# Altium schematic sheet PAGE2-POWER.SchDoc
size A3; DocumentNumber: 2; SheetNumber: 6; SheetTotal: 2
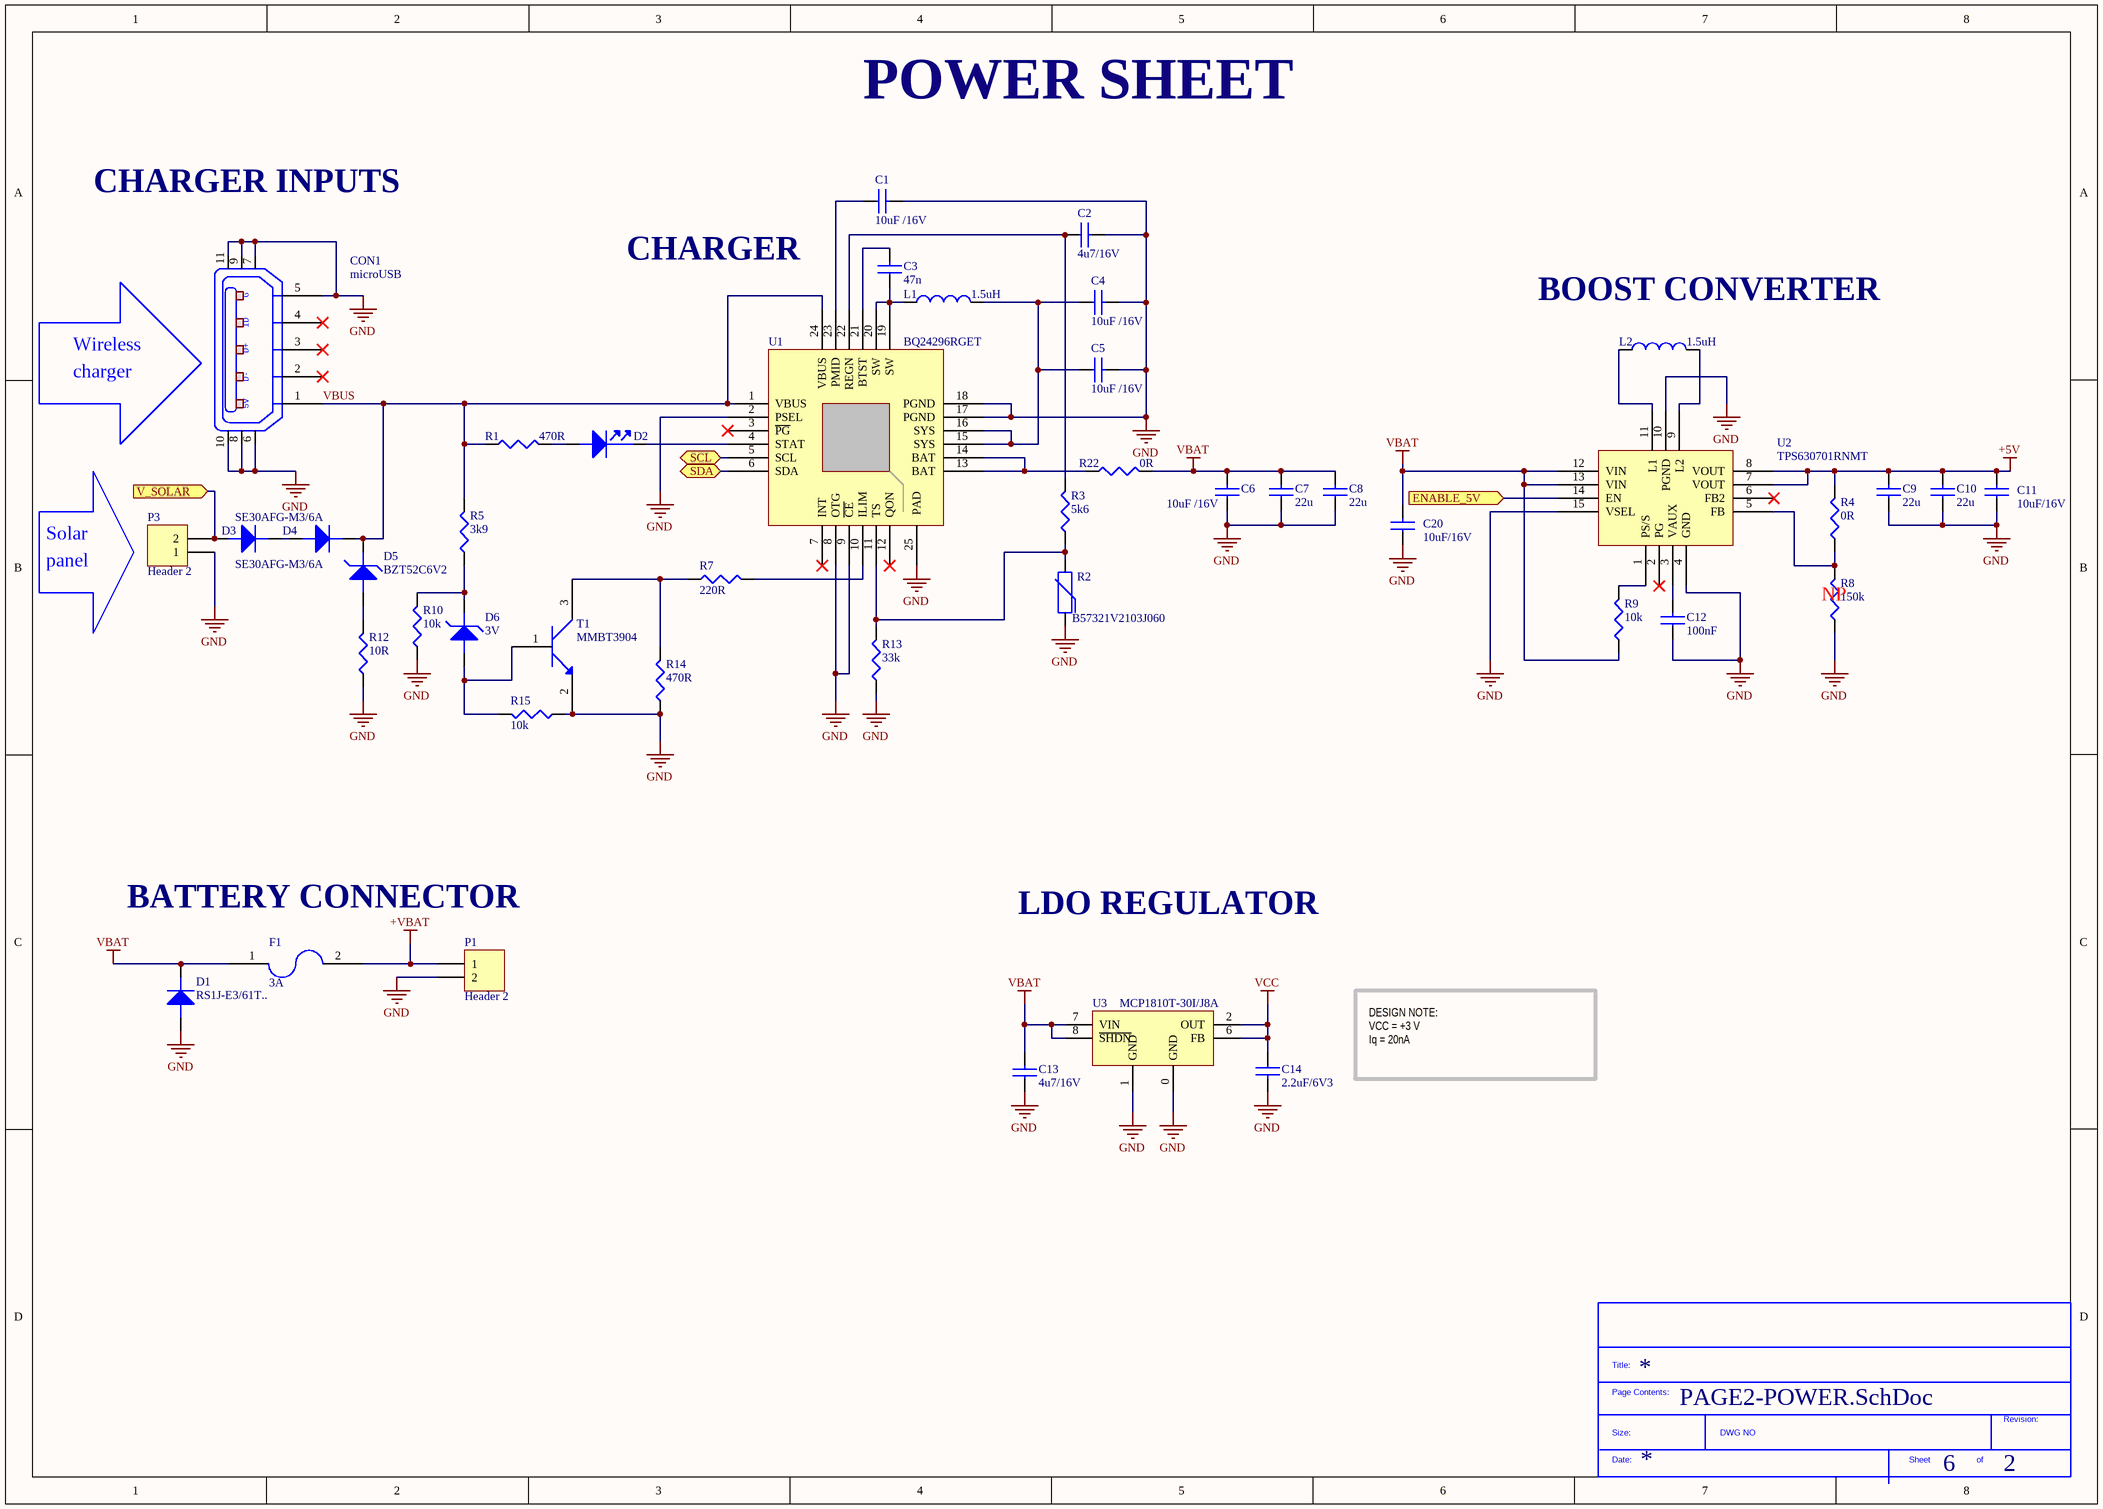
[diagram p0: PAGE2-POWER.SchDoc]

## Parts
*?  SDTitleBlock  (value not drawn)  (graphical)
C1  10uF /16V  [CAP0805]
C2  4u7/16V  [CAP0603]
C3  47n  [CAP0603]
C4  10uF /16V  [CAP0805]
C5  10uF /16V  [CAP0805]
C6  10uF /16V  [CAP0805]
C7  22u  [CAP0805]
C8  22u  [CAP0805]
C9  22u  [CAP0805]
C10  22u  [CAP0805]
C11  10uF/16V  [CAP0603]
C12  100nF  [CAP0603]
C13  4u7/16V  [CAP0603]
C14  2.2uF/6V3  [CAP0603]
C20  10uF/16V  [CAP0603]
CON1  microUSB  [microUSB-CHINA]  (no BOM)
D1  RS1J-E3/61T..  [SMC/DO-214AC]
D2  LED RED  [LED0603]  (value not drawn)
D3  SE30AFG-M3/6A  [SODFL127P600-8N]
D4  SE30AFG-M3/6A  [SODFL127P600-8N]
D5  BZT52C6V2  [SOD123]
D6  3V  [SOD-323 2L]
F1  3A  [Chip2PinSM127P600-8N]
L1  1.5uH  [FDSD0402]
L2  1.5uH  [FDSD0402]
P1  Header 2  [HDR1X2]  (no BOM)
P3  Header 2  [HDR1X2]  (no BOM)
R1  470R  [RES0603]
R2  B57321V2103J060  [RES0603]
R3  5k6  [RES0603]
R4  0R  [RES0603]
R5  3k9  [RES0603]
R7  220R  [RES0603]
R8  150k  [RES0603]
R9  10k  [RES0603]
R10  10k  [RES0603]
R12  10R  [RES0603]
R13  33k  [RES0603]
R14  470R  [RES0603]
R15  10k  [RES0603]
R22  0R  [RES0603]
T1  MMBT3904  [SOT23127P600-8N]
U1  BQ24296RGET  [QFN4x4]
U2  TPS630701RNMT  [VQFN TPS]
U3  MCP1810T-30I/J8A  [VDFN_2x2]

## Ports
ENABLE_5V (in), SCL (bidir), SDA (bidir), V_SOLAR (in)

## Nets
+5V: C9.2 C10.2 C11.2 R4.2 U2.7(VOUT) U2.8(VOUT)
+VBAT: F1.2 P1.1
GND: C1.2 C2.2 C4.2 C5.2 C6.1 C7.1 C8.1 C9.1 C10.1 C11.1 C12.1 C13.1 C14.2 C20.1 CON1.5(P5) CON1.6 CON1.7 CON1.8 CON1.9 CON1.10 CON1.11 D1.2(ANODE) P1.2 P3.1 R2.1 R8.1 R10.1 R12.1 R13.1 R14.1 R15.1 T1.2 U1.2(PSEL) U1.8(OTG) U1.9(~{CE}) U1.17(PGND) U1.18(PGND) U1.25(PAD) U2.4(GND) U2.10(PGND) U2.15(VSEL) U3.0(GND) U3.1(GND)
VBAT: C6.2 C7.2 C8.2 C13.2 C20.2 D1.1(cathode) F1.1 R9.1 R22.2 U2.12(VIN) U2.13(VIN) U3.7(VIN) U3.8(~{SHDN})
VCC: C14.1 U3.2(OUT) U3.6(FB)
ENABLE_5V: U2.14(EN) ; port ENABLE_5V
SCL: U1.5(SCL) ; port SCL
SDA: U1.6(SDA) ; port SDA
V_SOLAR: D3.2(ANODE) P3.2 ; port V_SOLAR
VBUS: CON1.1(P1) D4.1(cathode) D5.1(cathode) R1.1 R5.2 U1.1(VBUS) U1.24(VBUS)
NetC1_1: C1.1 U1.23(PMID)
NetC2_1: C2.1 R3.2 U1.22(REGN)
NetC3_1: C3.1 L1.1 U1.19(SW) U1.20(SW)
NetC3_2: C3.2 U1.21(BTST)
NetC4_1: C4.1 C5.1 L1.2 U1.15(SYS) U1.16(SYS)
NetC12_2: C12.2 U2.3(VAUX)
NetD2_1: D2.1(cathode) U1.4(STAT)
NetD2_2: D2.2(ANODE) R1.2
NetD3_1: D3.1(cathode) D4.2(ANODE)
NetD5_2: D5.2(ANODE) R12.2
NetD6_1: D6.1(cathode) R5.1 R10.2
NetD6_2: D6.2(ANODE) R15.2 T1.1
NetL2_1: L2.1 U2.11(L1)
NetL2_2: L2.2 U2.9(L2)
NetR2_2: R2.2 R3.1 R13.2 U1.11(TS)
NetR4_1: R4.1 R8.2 U2.5(FB)
NetR7_1: R7.1 R14.2 T1.3
NetR7_2: R7.2 U1.10(ILIM)
NetR9_2: R9.2 U2.1(PS/S)
NetR22_1: R22.1 U1.13(BAT) U1.14(BAT)

Not connected (* = marked no-connect by the designer): CON1 2(P2)* 3(P3)* 4(P4)*; U1 3(~{PG})* 7(INT)* 12(QON)*; U2 2(PG)* 6(FB2)*

## Notes on the sheet
- POWER SHEET
- CHARGER INPUTS
- CHARGER
- (near L2) BOOST CONVERTER
- Wireless
- charger
- Solar
- panel
- (near R8) NP
- BATTERY CONNECTOR
- LDO REGULATOR
- DESIGN NOTE:
  VCC = +3 V
  Iq = 20nA
- (in symbol Micro USB CHINA 1) G; ID; D+; D-; 5V
- (in symbol SDTitleBlock) Title:; Page Contents:; Revision:; Size:; DWG NO; Date:; Sheet; of

## Library data of the parts
C1 C4-C6 = 10uF /16V: TDK - CGA4J1X5R1C106K125AC - CAP, MLCC, X5R, 10UF, 16V, 0805; Manufacturer: TDK; Manufacturer Part Number: CGA4J1X5R1C106K125AC; RoHS: YES; ComponentLink1URL: http://bcove.me/e1v54mtm; ComponentLink1Description: http://bcove.me/e1v54mtm; ComponentLink2URL: http://www.farnell.com/datasheets/1936565.pdf; ComponentLink2Description: http://www.farnell.com/datasheets/1936565.pdf; ComponentLink3URL: http://www.farnell.com/datasheets/1683658.pdf; ComponentLink3Description: http://www.farnell.com/datasheets/1683658.pdf; Supplier 1: Farnell; Supplier Part Number 1: 2320856
C2 = 4u7  16V 0603: MURATA - GRM188R61C475KAAJD - CAP, MLCC, X5R, 4.7UF, 16V, 0603; Ceramic Capacitor Case: 0603 [1608 Metric]; Capacitance: 4.7; Voltage Rating: 16; Capacitance Tolerance: ± 10%; Dielectric Characteristic: X5; Product Range: GRM Series; SVHC: No SVHC (17-Dec-2015)<!--FANDB--><div class="features-and-benefits-container"><div class="features-and-benefits-desc-container"><span class="features-and-benefits-container-desc">SMD Multilayer Ceramic Capacitor, 0603 [1608 Metric], 4.7 µF, 16 V, ± 10%, X5; Supplier 1: Farnell; Manufacturer: MURATA; Manufacturer Part Number: GRM188R61C475KAAJD; RoHS: YES; Stock 1: 5038; Pricing 1: 10=0.16, 100=0.0929, 500=0.076, 1000=0.0618, 2000=0.0605, 4000=0.0425, 20000=0.0409, 40000=0.0355 (GBP); Packaging: Cut Tape; Operating Temperature Min: -55; Operating Temperature Max: 85; Automotive Qualification Standard: -; MSL: MSL 1 - Unlimited; ComponentLink1URL: http://www.farnell.com/datasheets/2079168.pdf; ComponentLink1Description: http://www.farnell.com/datasheets/2079168.pdf; Supplier Part Number 1: 2611924
C3 = 47nF / 50V: MULTICOMP - MC0603B473K500CT - CAP, MLCC, X7R, 47NF, 50V, 0603; Supplier 1: Farnell; Manufacturer: MULTICOMP; Manufacturer Part Number: MC0603B473K500CT; RoHS: YES; Stock 1: 34893; Pricing 1: 10=0.0102, 100=0.0086, 500=0.0069, 1000=0.0059, 2000=0.0051 (GBP); ComponentLink1URL: http://www.farnell.com/datasheets/1901289.pdf; ComponentLink1Description: http://www.farnell.com/datasheets/1901289.pdf; Supplier Part Number 1: 1759116
C7-C10 = 22u 6.3V 0805: MULTICOMP - MC0805X226M6R3CT - CAP, MLCC, X5R, 22UF, 0805; Ceramic Capacitor Case: 0805 [2012 Metric]; Capacitance: 22; Voltage Rating: 6.3; Capacitance Tolerance: ± 20%; Dielectric Characteristic: X5; Product Range: MC Series; SVHC: No SVHC (07-Jul-2017); Capacitor Terminals: SMD; Supplier 1: Farnell; Manufacturer: MULTICOMP; Manufacturer Part Number: MC0805X226M6R3CT; RoHS: YES; Stock 1: 74736; Pricing 1: 5=0.128, 50=0.0738, 250=0.0507, 500=0.042, 1500=0.0358 (GBP); Packaging: Cut Tape; Operating Temperature Min: -55; Operating Temperature Max: 85; Automotive Qualification Standard: -; MSL: -; Capacitance Tolerance ±: ± 20%; Operating Temperature Range: -55°C to +85°C<!--FANDB--><div class="features-and-benefits-container"><div class="features-and-benefits-desc-container"><span class="features-and-benefits-container-desc">SMD Multilayer Ceramic Capacitor, 0805 [2012 Metric], 22 µF, 6.3 V, ± 20%, X5R, MC Series</span></div><div class="features-and-benefits-description"><span class="features-benefits-value">The Multicomp MC series is general purpose MLCC capacitors with X5R dielectric material which provides high electrical precision, stability and reliability. This MLCC capacitor consists of a conducting material and electrodes with high density and high efficiency ceramic condensers.</span></div><div class="features-and-benefits-list"><ul class="features-and-benefits-list-list"><li class="features-and-benefits-list-item">Small size with higher capacitance values</li><li class="features-and-benefits-list-item">0201, 0402, 0603, 0805, 1206, 1210, 1812 case sizes available</li><li class="features-and-benefits-list-item">Capacitance value ranging from 100pF to 220?F</li><li class="features-and-benefits-list-item">Capacitor with lead free termination (pure Tin)</li><li class="features-and-benefits-list-item">High electrical precision, stability and reliability</li><li class="features-and-benefits-list-item">Rated voltage of 4V, 6.3V, 10V, 16V, 25V, 50V</li><li class="features-and-benefits-list-item">Operating temperature of -55°C to +85°C</li><li class="features-and-benefits-list-item">Available in ±10% and ±20; ComponentLink1URL: http://www.farnell.com/datasheets/1901289.pdf; ComponentLink1Description: http://www.farnell.com/datasheets/1901289.pdf; ComponentLink2URL: http://www.farnell.com/datasheets/1932399.pdf; ComponentLink2Description: http://www.farnell.com/datasheets/1932399.pdf; Supplier Part Number 1: 1759415
C11 C20 = 10uF/16V/0603: Multilayer Ceramic Capacitors MLCC - SMD/SMT 0603 10uF 16volts X5R 10%; Manufacturer: Murata; Manufacturer Part Number: GRM188R61C106KAALD; Voltage Rating DC: 16 VDC; Brand: Murata Electronics; Class: Class 2; Type: General Purpose Ceramic Capacitors; Unit Weight: 0.000222 oz; Supplier 1: Farnell; Stock 1: 13160; Pricing 1: 10=0.442, 100=0.241, 500=0.166, 1000=0.129 (GBP); Product Category: Multilayer Ceramic Capacitors MLCC - SMD/SMT; RoHS: True; Capacitance: 10 uF; Dielectric: X5R; Tolerance: 10 %; Case Code - in: 0603; Case Code - mm: 1608; Height: 0.8 mm; Maximum Operating Temperature: + 85 C; Minimum Operating Temperature: - 55 C; Product: General Type MLCCs; Series: GRM; Packaging: Reel; Length: 1.6 mm; Package / Case: 0603 (1608 metric); Factory Pack Quantity: 4000; Termination Style: SMD/SMT; Width: 0.8 mm; Supplier Part Number 1: 2611923
C12 = 100nF: MURATA - GRM188R71C104KA01J - CAP, MLCC, X7R, 0.1UF, 16V, 0603; Ceramic Capacitor Case: 0603 [1608 Metric]; Capacitance: 0.1; Voltage Rating: 16; Capacitance Tolerance: ± 10%; Dielectric Characteristic: X7; Product Range: GRM Series; SVHC: No SVHC (20-Jun-2016; Supplier 1: Farnell; Manufacturer: MURATA; Manufacturer Part Number: GRM188R71C104KA01J; RoHS: YES; Stock 1: 18297; Pricing 1: 10=0.0145, 100=0.0126, 500=0.0081, 2500=0.0059, 5000=0.0052, 10000=0.0046, 50000=0.0036, 100000=0.0035 (GBP); Packaging: Cut Tape; Operating Temperature Min: -55; Operating Temperature Max: 125; Automotive Qualification Standard: -; MSL: MSL 1 - Unlimited; ComponentLink1URL: http://www.farnell.com/datasheets/2189124.pdf; ComponentLink1Description: http://www.farnell.com/datasheets/2189124.pdf; Supplier Part Number 1: 2688519
C13 = C - 4u7  16V 0603: MURATA - GRM188R61C475KAAJD - CAP, MLCC, X5R, 4.7UF, 16V, 0603; IRNAS Part No.: I-200001; Ceramic Capacitor Case: 0603 [1608 Metric]; Capacitance: 4.7; Voltage Rating: 16; Capacitance Tolerance: ± 10%; Dielectric Characteristic: X5; Product Range: GRM Series; SVHC: No SVHC (17-Dec-2015)<!--FANDB--><div class="features-and-benefits-container"><div class="features-and-benefits-desc-container"><span class="features-and-benefits-container-desc">SMD Multilayer Ceramic Capacitor, 0603 [1608 Metric], 4.7 µF, 16 V, ± 10%, X5; Supplier 1: Farnell; Manufacturer: MURATA; Manufacturer Part Number: GRM188R61C475KAAJD; RoHS: YES; Stock 1: 5038; Pricing 1: 10=0.16, 100=0.0929, 500=0.076, 1000=0.0618, 2000=0.0605, 4000=0.0425, 20000=0.0409, 40000=0.0355 (GBP); Packaging: Cut Tape; Operating Temperature Min: -55; Operating Temperature Max: 85; Automotive Qualification Standard: -; MSL: MSL 1 - Unlimited; ComponentLink1URL: http://www.farnell.com/datasheets/2079168.pdf; ComponentLink1Description: http://www.farnell.com/datasheets/2079168.pdf; Supplier Part Number 1: 2611924
C14 = C - 2.2uF/6V3/0603: SMD Multilayer Ceramic Capacitor, 2.2 µF, 6.3 V, 0603 [1608 Metric], ± 10%, X5R, MC Series; ComponentLink1Description: Datashet; ComponentLink1URL: http://www.farnell.com/datasheets/1901289.pdf?_ga=2.188069613.43509124.1568358807-1741076818.1563951383; Supplier 1: Farnell; Supplier Part Number 1: 1759392
CON1 = Micro USB CHINA 1
D1 = RS1J-E3/61T..: VISHAY - RS1J-E3/61T.. - DIODE, FAST, 1A, 600V, SMD; Repetitive Reverse Voltage Vrrm Max: 600; Forward Current If(AV): 1; Diode Configuration: Single; Forward Voltage VF Max: 1.3; Reverse Recovery Time trr Max: 250; Forward Surge Current Ifsm Max: 30; Diode Case Style: DO-214; No. of Pins: 2 Pin; Product Range: RS1; SVHC: No SVHC (15-Jun-2015); Diode Type: Fast Recovery; External Depth: 2.79; External Length / Height: 2.29; External Width: 5.28; Junction Temperature Tj Max: 150; Supplier 1: Farnell; Manufacturer: VISHAY; Manufacturer Part Number: RS1J-E3/61T..; RoHS: YES; Stock 1: 4705; Pricing 1: 10=0.164, 100=0.111, 200=0.093, 500=0.0847, 1000=0.083, 3000=0.0813, 9000=0.0796, 30000=0.0779 (GBP); Operating Temperature Max: 150; Packaging: Cut Tape; Automotive Qualification Standard: -; Alternate Case Style: DO-214; Current Ifsm: 30; Forward Current If Max: 1; Forward Voltage: 1.3; Operating Temperature Min: -55; Operating Temperature Range: -55°C to +150; Tape Width: 12mm<!--FANDB--><div class="features-and-benefits-container"><div class="features-and-benefits-desc-container"><span class="features-and-benefits-container-desc">Fast / Ultrafast Diode, 600 V, 1 A, Single, 1.3 V, 250 ns, 30 A</span></div><div class="features-and-benefits-description"><span class="features-benefits-value">The RS1J-E3/5AT is a surface-mount Fast Switching Rectifier with solderable matte tin-plated terminals. It is suitable for use in fast switching rectification of power supply, inverters, converters and freewheeling diodes.</span></div><div class="features-and-benefits-list"><ul class="features-and-benefits-list-list"><li class="features-and-benefits-list-item">Colour band denotes cathode end</li><li class="features-and-benefits-list-item">Low-profile package</li><li class="features-and-benefits-list-item">Ideal for automated placement</li><li class="features-and-benefits-list-item">Glass-passivated pallet chip junction</li><li class="features-and-benefits-list-item">Fast switching for high efficiency</li><li class="features-and-benefits-list-item">High forward surge capability</li><li class="features-and-benefits-list-item">Meets MSL level 1 as per J-STD-020, LF maximum peak of 260°C</li><li class="features-and-benefits-list-item">AEC-Q101 qualified</li><li class="features-and-benefits-list-item">UL94V-0 Flammability rating</li></ul></div><div class="features-and-benefits-applications"><ul class="features-and-benefits-value"><li class="features-and-benefits-list-item">Power Management</li><li class="features-and-benefits-list-item">Consumer Electronics</li><li class="features-and-benefits-list-item">Commercial</li><li class="features-and-benefits-list-item">Communications & Networking</li><li class="features-and-benefits-list-item">Automotive</li></ul></div></div>; ComponentLink1URL: http://www.vishay.com/docs/88869/packagin.pdf; ComponentLink1Description: http://www.vishay.com/docs/88869/packagin.pdf; ComponentLink2URL: http://www.vishay.com/doc?88707; ComponentLink2Description: http://www.vishay.com/doc?88707; ComponentLink3URL: http://www.farnell.com/datasheets/2244878.pdf; ComponentLink3Description: http://www.farnell.com/datasheets/2244878.pdf; Supplier Part Number 1: 9550143
D2 = LED RED: BROADCOM LIMITED - HSMS-C190 - LED, RED, 10MCD, 626NM; LED Mounting: SMD; Forward Current If: 20; Forward Voltage: 2.1; Wavelength Typ: 626; Luminous Intensity: 10; Viewing Angle: 170°; Lens Shape: Rectangular; SVHC: No SVHC (17-Dec-2015)<!--FANDB--><div class="features-and-benefits-container"><div class="features-and-benefits-description"><span class="features-benefits-value">The HSMS-C190 is a HER SMD Chip LED with untinted/diffused lens, made of GaP. It is designed in an industry standard package 1.6 x 0.8mm footprint with 0.8mm profile. It is compatible with IR reflow solder processes. The small size and wide viewing angle make this LED prime choices for backlighting applications and front panel illumination especially where space is a premium.</span></div><div class="features-and-benefits-list"><ul class="features-and-benefits-list-list"><li class="features-and-benefits-list-item">Small size</li><li class="features-and-benefits-list-item">Industry standard footprint</li><li class="features-and-benefits-list-item">Compatible with IR solder</li><li class="features-and-benefits-list-item">Diffused optics</li><li class="features-and-benefits-list-item">-40 to 85; Supplier 1: Farnell; Manufacturer: BROADCOM LIMITED; Manufacturer Part Number: HSMS-C190; RoHS: YES; Stock 1: 7534; Pricing 1: 1=0.361, 10=0.256, 50=0.235, 100=0.106, 200=0.101 (GBP); LED Colour: Red; Bulb Size: -; Packaging: Cut Tape; Product Range: -; Automotive Qualification Standard: -; MSL: -; ComponentLink1URL: http://www.farnell.com/datasheets/313031.pdf; ComponentLink1Description: http://www.farnell.com/datasheets/313031.pdf; ComponentLink2URL: http://www.farnell.com/datasheets/1681524.pdf; ComponentLink2Description: http://www.farnell.com/datasheets/1681524.pdf; ComponentLink3URL: http://www.farnell.com/datasheets/2165483.pdf; ComponentLink3Description: http://www.farnell.com/datasheets/2165483.pdf; Supplier Part Number 1: 2497356
D3 D4 = SE30AFG-M3/6A: VISHAY - SE30AFG-M3/6A - RECTIFIER, ESD, 400V, 3A, DO-221AC; Repetitive Reverse Voltage Vrrm Max: 400; Forward Current If(AV): 3; Diode Configuration: Single; Forward Voltage VF Max: 1.1; Reverse Recovery Time trr Max: 1.5; Forward Surge Current Ifsm Max: 40; Diode Case Style: DO-221; No. of Pins: 2; Product Range: SE30; Diode Type: Standard Recovery; Supplier 1: Farnell; Manufacturer: VISHAY; Manufacturer Part Number: SE30AFG-M3/6A; RoHS: YES; Stock 1: 13984; Pricing 1: 1=0.306, 25=0.0765, 100=0.0753, 250=0.0729, 500=0.072, 1000=0.0654 (GBP); Operating Temperature Max: 175; Packaging: Each; Automotive Qualification Standard: -; MSL: MSL 1 - Unlimited; Operating Temperature Min: -55°C<!--FANDB--><div class="features-and-benefits-container"><div class="features-and-benefits-desc-container"><span class="features-and-benefits-container-desc">Standard Recovery Diode, 400 V, 3 A, Single, 1.1 V, 1.5 µs, 40 A</span></div><div class="features-and-benefits-description"><span class="features-benefits-value">The SE30AFG-M3/6A is a surface-mount ESD Capability Rectifier with matte tin-plated solderable leads. It is suitable for use in general-purpose, polarity protection and rail-to-rail protection.</span></div><div class="features-and-benefits-list"><ul class="features-and-benefits-list-list"><li class="features-and-benefits-list-item">Oxide planar chip junction</li><li class="features-and-benefits-list-item">Low forward voltage drop, low leakage current</li><li class="features-and-benefits-list-item">Very low profile - Typical height of 0.95; ComponentLink1URL: http://www.farnell.com/datasheets/2049981.pdf; ComponentLink1Description: http://www.farnell.com/datasheets/2049981.pdf; Supplier Part Number 1: 2313878
D5 = BZT52C6V2: DIODES INC. - BZT52C6V2 - DIODE, ZENER, 6.2V, 0.5W, SOD-123; Zener Voltage Vz Typ: 6.2; Power Dissipation Pd: 500; Zener Tolerance ±: 6%; No. of Pins: 2; Product Range: BZT52 Series; SVHC: No SVHC (12-Jan-2017); Supplier 1: Farnell; Manufacturer: DIODES INC.; Manufacturer Part Number: BZT52C6V2; RoHS: YES; Stock 1: 4408; Pricing 1: 1=0.415, 25=0.264, 100=0.0727, 250=0.0546, 500=0.047, 1000=0.0334, 3000=0.0278, 7000=0.0236 (GBP); Diode Case Style: SOD-123; Operating Temperature Max: 150; Packaging: Cut Tape; Automotive Qualification Standard: -; MSL: MSL 1 - Unlimited; Operating Temperature Min: -65; Operating Temperature Range: -65°C to +150°C<!--FANDB--><div class="features-and-benefits-container"><div class="features-and-benefits-desc-container"><span class="features-and-benefits-container-desc">Zener Single Diode, 6.2 V, 500 mW, SOD-123, 6 %, 2 Pins, 150 °C</span></div><div class="features-and-benefits-description"><span class="features-benefits-value">The BZT52C6V2 is a surface mount Zener Diode with moulded plastic case, matte tin annealed over Alloy 42 lead frame (lead-free plating) terminals and cathode band polarity. It is ideally suited for automated assembly processes.</span></div><div class="features-and-benefits-list"><ul class="features-and-benefits-list-list"><li class="features-and-benefits-list-item">Planar die construction</li><li class="features-and-benefits-list-item">500mW Power dissipation</li><li class="features-and-benefits-list-item">General purpose, medium current</li><li class="features-and-benefits-list-item">Totally lead-free</li><li class="features-and-benefits-list-item">Halogen and antimony-free - Green device</li><li class="features-and-benefits-list-item">Qualified to AEC-Q101 standards for high reliability</li></ul></div><div class="features-and-benefits-applications"><ul class="features-and-benefits-value"><li class="features-and-benefits-list-item">Automation & Process Control</li></ul></div></div>; ComponentLink1URL: http://www.farnell.com/datasheets/1670962.pdf; ComponentLink1Description: http://www.farnell.com/datasheets/1670962.pdf; Supplier Part Number 1: 1902438
D6 = MM3Z3V0T1G: ON SEMICONDUCTOR - MM3Z3V0T1G - ZENER DIODE, 200MW, 3V, SOD-323; Zener Voltage Vz Typ: 3; Power Dissipation Pd: 300; Zener Tolerance ±: 5%; No. of Pins: 2; Product Range: MM3Z3 Series; SVHC: No SVHC (07-Jul-2017); Supplier 1: Farnell; Manufacturer: ON SEMICONDUCTOR; Manufacturer Part Number: MM3Z3V0T1G; RoHS: YES; Stock 1: 6591; Pricing 1: 5=0.126, 50=0.0544, 250=0.0443, 500=0.0288, 1500=0.0274 (GBP); Diode Case Style: SOD-323; Operating Temperature Max: 150; Packaging: Cut Tape; Automotive Qualification Standard: -; MSL: MSL 1 - Unlimited<!--FANDB--><div class="features-and-benefits-container"><div class="features-and-benefits-desc-container"><span class="features-and-benefits-container-desc">Zener Single Diode, 3 V, 300 mW, SOD-323, 5 %, 2 Pins, 150 °C</span></div></div>; ComponentLink1URL: http://www.farnell.com/datasheets/1876691.pdf; ComponentLink1Description: http://www.farnell.com/datasheets/1876691.pdf; ComponentLink2URL: http://www.farnell.com/datasheets/2306645.pdf; ComponentLink2Description: http://www.farnell.com/datasheets/2306645.pdf; Supplier Part Number 1: 2463510
F1 = PTC FUSE 3A: LITTELFUSE - MINISMDC150F/24-2 - POLYSWITCH, SMD, 1812, 1.5A; Supplier 1: Farnell; Manufacturer: LITTELFUSE; Manufacturer Part Number: MINISMDC150F/24-2; RoHS: YES; Stock 1: 9256; Pricing 1: 1=0.463, 50=0.382, 100=0.327, 250=0.302, 500=0.256, 1000=0.254, 5000=0.253, 10000=0.251 (GBP); ComponentLink1URL: http://www.farnell.com/datasheets/2363925.pdf; ComponentLink1Description: http://www.farnell.com/datasheets/2363925.pdf; ComponentLink2URL: http://www.farnell.com/datasheets/2282569.pdf; ComponentLink2Description: http://www.farnell.com/datasheets/2282569.pdf; Supplier Part Number 1: 1345929
L1 L2 = 1.5uH 5.1A: MURATA - FDSD0420-H-1R5M=P3 - INDUCTOR, SHIELDED, 1.5UH, 5.1A, 20%; Product Range: FDSD0420 Series; Inductance: 1.5; RMS Current (Irms): 5.1; Saturation Current (Isat): 7.7; DC Resistance Max: 0.036; Power Inductor Case: 4.2mm x 4.2mm x 2; SVHC: No SVHC (17-Dec-2015); Supplier 1: Farnell; Manufacturer: MURATA; Manufacturer Part Number: FDSD0420-H-1R5M=P3; RoHS: YES; Stock 1: 1471; Pricing 1: 5=0.79, 50=0.448, 250=0.422, 500=0.377, 1000=0.305, 2000=0.298, 10000=0.291, 20000=0.284 (GBP); Inductor Construction: Shielded; Inductance Tolerance: ± 20%; Packaging: Each; MSL: MSL 1 - Unlimited<!--FANDB--><div class="features-and-benefits-container"></div>; ComponentLink1URL: http://www.farnell.com/datasheets/2021980.pdf; ComponentLink1Description: http://www.farnell.com/datasheets/2021980.pdf; Supplier Part Number 1: 2530091
P1 P3 = Header 2: Header, 2-Pin; LatestRevisionDate: 17-Jul-2002; LatestRevisionNote: Re-released for DXP Platform.; Publisher: Altium Limited
R1 R14 = 470R: MULTICOMP - MCMR06X471 JTL - RES, CERAMIC, 470R, 5%, 0.1W, 0603; Supplier 1: Farnell; Manufacturer: MULTICOMP; Manufacturer Part Number: MCMR06X471 JTL; RoHS: Y-EX; Stock 1: 3786; Pricing 1: 10=0.0089, 100=0.0076, 500=0.0063, 1000=0.0049, 2500=0.0033, 5000=0.0024, 25000=0.0016, 50000=0.0013 (GBP); ComponentLink1URL: http://www.farnell.com/datasheets/1716707.pdf; ComponentLink1Description: http://www.farnell.com/datasheets/1716707.pdf; Supplier Part Number 1: 2073513
R2 = R - B57321V2103J060: Thermistor, NTC, 10 kohm, B57321V2 Series, 4000 K, SMD, 0603 [1608 Metric]; ComponentLink1Description: Datasheet; ComponentLink1URL: http://www.farnell.com/datasheets/2095479.pdf?_ga=2.12516721.43509124.1568358807-1741076818.1563951383; Supplier 1: Farnell; Supplier Part Number 1: 1299914
R3 = 5k6: MULTICOMP - MCMR06X5601FTL - RES, CERAMIC, 5K6, 1%, 0.1W, 0603; Resistance: 5.6; Voltage Rating: 75; Resistor Case Style: 0603 [1608 Metric]; Power Rating: 100; Product Range: MCMR Series; Temperature Coefficient: ± 100; SVHC: No SVHC (07-Jul-2017); Resistor Mounting: Surface Mount Device<!--FANDB--><div class="features-and-benefits-container"><div class="features-and-benefits-desc-container"><span class="features-and-benefits-container-desc">SMD Chip Resistor, Ceramic, 5.6 kohm, 75 V, 0603 [1608 Metric], 100 mW, ± 1%, MCMR Series</span></div><div class="features-and-benefits-description"><span class="features-benefits-value">The Multicomp MCMR series resistors are automotive grade, anti sulphured thick film chip resistor. The resistance range includes E24 and E96 decade values from 1ohm to 10Mohm. These resistors are constructed on top of a high grade ceramic body.</span></div><div class="features-and-benefits-list"><ul class="features-and-benefits-list-list"><li class="features-and-benefits-list-item">EIA 0402, 0603, 0805, 1206 chip sizes available</li><li class="features-and-benefits-list-item">High reliability and stability</li><li class="features-and-benefits-list-item">Automotive grade AEC-Q200 compliant</li><li class="features-and-benefits-list-item">Complaint with (IEC 60068-1) 55/155/56 climatic category</li><li class="features-and-benefits-list-item">Maximum operation voltage of 50V, 75V, 150V and 200V</li><li class="features-and-benefits-list-item">Power rating of 62.5mW, 100mW, 125mW and 250mW</li><li class="features-and-benefits-list-item">Available in ±1% and ±5% tolerance</li><li class="features-and-benefits-list-item">Temperature coefficient (TCR) of +200ppm/°C, +100ppm/°C and -200ppm/°C to +400ppm/°C</li><li class="features-and-benefits-list-item">Operating temperature range -55°C to 155; Supplier 1: Farnell; Manufacturer: MULTICOMP; Manufacturer Part Number: MCMR06X5601FTL; RoHS: Y-EX; Stock 1: 9135; Pricing 1: 10=0.0088, 100=0.0053, 500=0.0037, 1000=0.0029, 2500=0.0024 (GBP); Resistance Tolerance: ± 1%; Packaging: Cut Tape; Resistor Element Material: Ceramic; Automotive Qualification Standard: -; ComponentLink1URL: http://www.farnell.com/datasheets/1716707.pdf; ComponentLink1Description: http://www.farnell.com/datasheets/1716707.pdf; Supplier Part Number 1: 2073537
R4 R22 = 0R: BOURNS - CR0603-J/-000ELF - RES, THICK FILM, 0R, 5%, 0.1W, 0603; Resistance: 0; Voltage Rating: 50; Resistor Case Style: 0603 [1608 Metric]; Power Rating: 100; Product Range: CR Series; SVHC: No SVHC (17-Dec-2015); Resistor Mounting: Surface Mount Device<!--FANDB--><div class="features-and-benefits-container"><div class="features-and-benefits-description"><span class="features-benefits-value">The Bourns CR series are standard thick film chip resistors. These resistors provide flexibility of performance, space saving and low cost. The Resistance range includes E96 and E24 decade values from 1ohm to 10Mohm.</span></div><div class="features-and-benefits-list"><ul class="features-and-benefits-list-list"><li class="features-and-benefits-list-item">0201, 0402, 0603, 0805, 1206, 1210, 2010, 2512 standard case sizes available</li><li class="features-and-benefits-list-item">±1% and ±5% tolerance</li><li class="features-and-benefits-list-item">±100ppm/°C, ±200ppm/°C and ±250ppm/°C TCR values available</li><li class="features-and-benefits-list-item">Power rating selectable for 50mW, 63mW, 0.1W, 0.125W, 0.25W, 0.5W and 1W based on ordering</li><li class="features-and-benefits-list-item">Jumpers are available for all size</li><li class="features-and-benefits-list-item">3 layer termination process with nickel barrier prevents leaching & provides excellent solderability</li><li class="features-and-benefits-list-item">Suitable for all type of soldering processes</li><li class="features-and-benefits-list-item">Tight dimensional tolerances</li><li class="features-and-benefits-list-item">Maximum working voltage depends on case size</li><li class="features-and-benefits-list-item">Operating temperature of -55°C to +125°C(CR0201) and -55°C to +155; Supplier 1: Farnell; Manufacturer: BOURNS; Manufacturer Part Number: CR0603-J/-000ELF; RoHS: YES; Stock 1: 58200; Pricing 1: 10=0.0146, 250=0.0097, 1000=0.0073, 5000=0.0049, 12500=0.0042 (GBP); Resistance Tolerance: ± 5%; Packaging: Cut Tape; Resistor Element Material: Thick Film; Temperature Coefficient: -; Automotive Qualification Standard: -; MSL: MSL 1 - Unlimited; ComponentLink1URL: http://www.bourns.com/engineering/CHPREZTR/cr0603.stp; ComponentLink1Description: http://www.bourns.com/engineering/CHPREZTR/cr0603.stp; ComponentLink2URL: http://www.farnell.com/datasheets/2178762.pdf; ComponentLink2Description: http://www.farnell.com/datasheets/2178762.pdf; Supplier Part Number 1: 2008343
R5 = 3k9: MULTICOMP - MCWR06X3901FTL - RES, THICK FILM, 3K9, 1%, 0.1W, 0603; Resistance: 3.9; Voltage Rating: 50; Resistor Case Style: 0603 [1608 Metric]; Power Rating: 100; Product Range: MCWR Series; Temperature Coefficient: ± 100; SVHC: No SVHC (07-Jul-2017)<!--FANDB--><div class="features-and-benefits-container"><div class="features-and-benefits-desc-container"><span class="features-and-benefits-container-desc">SMD Chip Resistor, Thick Film, 3.9 kohm, 50 V, 0603 [1608 Metric], 100 mW, ± 1; Supplier 1: Farnell; Manufacturer: MULTICOMP; Manufacturer Part Number: MCWR06X3901FTL; RoHS: Y-EX; Stock 1: 19057; Pricing 1: 10=0.0032, 100=0.002, 500=0.0013, 1000=0.0011, 2500=0.0009 (GBP); Resistance Tolerance: ± 1%; Packaging: Cut Tape; Resistor Element Material: Thick Film; Automotive Qualification Standard: -; ComponentLink1URL: http://www.farnell.com/datasheets/1849611.pdf; ComponentLink1Description: http://www.farnell.com/datasheets/1849611.pdf; Supplier Part Number 1: 2447363
R7 = 220R: MULTICOMP - MCWR06X2200FTL - RES, THICK FILM, 220R, 1%, 0.1W, 0603; Resistance: 220; Voltage Rating: 50; Resistor Case Style: 0603 [1608 Metric]; Power Rating: 100; Product Range: MCWR Series; Temperature Coefficient: ± 100; SVHC: No SVHC (07-Jul-2017)<!--FANDB--><div class="features-and-benefits-container"><div class="features-and-benefits-desc-container"><span class="features-and-benefits-container-desc">SMD Chip Resistor, Thick Film, 220 ohm, 50 V, 0603 [1608 Metric], 100 mW, ± 1; Supplier 1: Farnell; Manufacturer: MULTICOMP; Manufacturer Part Number: MCWR06X2200FTL; RoHS: Y-EX; Stock 1: 124834; Pricing 1: 10=0.0031, 100=0.0018, 500=0.0013, 1000=0.001, 2500=0.0008 (GBP); Resistance Tolerance: ± 1%; Packaging: Cut Tape; Resistor Element Material: Thick Film; Automotive Qualification Standard: -; ComponentLink1URL: http://www.farnell.com/datasheets/1849611.pdf; ComponentLink1Description: http://www.farnell.com/datasheets/1849611.pdf; Supplier Part Number 1: 2447298
R8 = 150k: MULTICOMP - MCWR06X1503FTL - RES, THICK FILM, 150KOHM, 1%, 0.1W; Resistance: 150; Voltage Rating: 50; Resistor Case Style: 0603 [1608 Metric]; Power Rating: 100; Product Range: MCWR Series; Temperature Coefficient: ± 100; SVHC: No SVHC (07-Jul-2017)<!--FANDB--><div class="features-and-benefits-container"><div class="features-and-benefits-desc-container"><span class="features-and-benefits-container-desc">SMD Chip Resistor, Thick Film, 150 kohm, 50 V, 0603 [1608 Metric], 100 mW, ± 1; Supplier 1: Farnell; Manufacturer: MULTICOMP; Manufacturer Part Number: MCWR06X1503FTL; RoHS: Y-EX; Stock 1: 11455; Pricing 1: 10=0.0033, 100=0.002, 500=0.0014, 1000=0.0011, 2500=0.0009 (GBP); Resistance Tolerance: ± 1%; Packaging: Cut Tape; Resistor Element Material: Thick Film; Automotive Qualification Standard: -; ComponentLink1URL: http://www.farnell.com/datasheets/1849611.pdf; ComponentLink1Description: http://www.farnell.com/datasheets/1849611.pdf; Supplier Part Number 1: 2447254
R9 R10 R15 = 10k: MULTICOMP - MCMR06X103 JTL - RES, CERAMIC, 10K, 5%, 0.1W, 0603; Resistance: 10; Voltage Rating: 75; Resistor Case Style: 0603 [1608 Metric]; Power Rating: 100; Product Range: MCMR Series; Temperature Coefficient: ± 100; Automotive Qualification Standard: -<!--FANDB--><div class="features-and-benefits-container"><div class="features-and-benefits-description"><span class="features-benefits-value">The Multicomp MCMR series resistors are automotive grade, anti sulphured thick film chip resistor. The resistance range includes E24 and E96 decade values from 1ohm to 10Mohm. These resistors are constructed on top of a high grade ceramic body.</span></div><div class="features-and-benefits-list"><ul class="features-and-benefits-list-list"><li class="features-and-benefits-list-item">EIA 0402, 0603, 0805, 1206 chip sizes available</li><li class="features-and-benefits-list-item">High reliability and stability</li><li class="features-and-benefits-list-item">Automotive grade AEC-Q200 compliant</li><li class="features-and-benefits-list-item">Complaint with (IEC 60068-1) 55/155/56 climatic category</li><li class="features-and-benefits-list-item">Maximum operation voltage of 50V, 75V, 150V and 200V</li><li class="features-and-benefits-list-item">Power rating of 62.5mW, 100mW, 125mW and 250mW</li><li class="features-and-benefits-list-item">Available in ±1% and ±5% tolerance</li><li class="features-and-benefits-list-item">Temperature coefficient (TCR) of +200ppm/°C, +100ppm/°C and -200ppm/°C to +400ppm/°C</li><li class="features-and-benefits-list-item">Operating temperature range -55°C to 155; Supplier 1: Farnell; Manufacturer: MULTICOMP; Manufacturer Part Number: MCMR06X103 JTL; RoHS: Y-EX; Stock 1: 19791; Pricing 1: 10=0.0087, 100=0.0074, 500=0.0061, 1000=0.0048, 2500=0.0032, 5000=0.0024, 25000=0.0016, 50000=0.0013 (GBP); Resistance Tolerance: ± 5%; Packaging: Cut Tape; Resistor Element Material: Ceramic; ComponentLink1URL: http://www.farnell.com/datasheets/1716707.pdf; ComponentLink1Description: http://www.farnell.com/datasheets/1716707.pdf; Supplier Part Number 1: 2073356
R12 = 10R: VISHAY - RCA060310R0FKEA - RES, AUTO, THICK FILM, 10R, 1%, 0603; Resistance: 10; Voltage Rating: 75; Resistor Case Style: 0603 [1608 Metric]; Power Rating: 100; Product Range: RCA Series; Temperature Coefficient: ± 100; Automotive Qualification Standard: AEC-Q200; SVHC: No SVHC (17-Dec-2015)<!--FANDB--><div class="features-and-benefits-container"><div class="features-and-benefits-description"><span class="features-benefits-value">The RCA series from Vishay are automotive grade, sulphur resistant thick film rectangular chip resistors. The resistance range includes E24 and E96 decade values from 1ohm to 10Mohm. They provide superior resistance against H2S atmosphere. These resistors have metal glaze on high quality ceramic.</span></div><div class="features-and-benefits-list"><ul class="features-and-benefits-list-list"><li class="features-and-benefits-list-item">Automotive grade AEC-Q200 qualified (rev C)</li><li class="features-and-benefits-list-item">EIA 0402, 0603, 0805, 1206, 1210, 1218, 2010 and 2512 case sizes available</li><li class="features-and-benefits-list-item">Available in ±0.5%, ±1% and ±5% tolerances</li><li class="features-and-benefits-list-item">Jumpers are also available</li><li class="features-and-benefits-list-item">±50ppm/K, ±100ppm/K and ±200ppm/K TCR values</li><li class="features-and-benefits-list-item">Power rating of 0.063W, 0.10W, 0.125W, 0.25W, 0.5W, 0.75W and 1W at 70?C</li><li class="features-and-benefits-list-item">Available in 50V, 75V, 150V, 200V, 400V and 500V limiting voltage options</li><li class="features-and-benefits-list-item">Category temperature range from -55?C to 155?C</li><li class="features-and-benefits-list-item">Stability ?R/R = 1 % for 1000h at 70; Supplier 1: Farnell; Manufacturer: VISHAY; Manufacturer Part Number: RCA060310R0FKEA; RoHS: YES; Stock 1: 9559; Pricing 1: 10=0.0803, 100=0.0386, 500=0.0235, 2500=0.015, 5000=0.0135, 10000=0.0108, 50000=0.0068, 100000=0.0067 (GBP); Resistance Tolerance: ± 1%; Packaging: Cut Tape; Resistor Element Material: Thick Film; ComponentLink1URL: http://www.farnell.com/datasheets/2111201.pdf; ComponentLink1Description: http://www.farnell.com/datasheets/2111201.pdf; Supplier Part Number 1: 2616585
R13 = 33k: MULTICOMP - MCWR06X3302FTL - RES, THICK FILM, 33K, 1%, 0.1W, 0603; Resistance: 33; Voltage Rating: 50; Resistor Case Style: 0603 [1608 Metric]; Power Rating: 100; Product Range: MCWR Series; Temperature Coefficient: ± 100; SVHC: No SVHC (07-Jul-2017)<!--FANDB--><div class="features-and-benefits-container"><div class="features-and-benefits-desc-container"><span class="features-and-benefits-container-desc">SMD Chip Resistor, Thick Film, 33 kohm, 50 V, 0603 [1608 Metric], 100 mW, ± 1; Supplier 1: Farnell; Manufacturer: MULTICOMP; Manufacturer Part Number: MCWR06X3302FTL; RoHS: Y-EX; Stock 1: 10138; Pricing 1: 10=0.0033, 100=0.002, 500=0.0014, 1000=0.0011, 2500=0.0009 (GBP); Resistance Tolerance: ± 1%; Packaging: Cut Tape; Resistor Element Material: Thick Film; Automotive Qualification Standard: -; ComponentLink1URL: http://www.farnell.com/datasheets/1849611.pdf; ComponentLink1Description: http://www.farnell.com/datasheets/1849611.pdf; Supplier Part Number 1: 2447342
T1 = MMBT3904: ON SEMICONDUCTOR/FAIRCHILD - MMBT3904 - TRANSISTOR, NPN, SOT-23; Collector Emitter Voltage V(br)ceo: 40; Transition Frequency ft: 300; Power Dissipation Pd: 350; DC Collector Current: 200; No. of Pins: 3; SVHC: No SVHC (15-Jun-2015); Current Ic hFE: 10; Device Marking: BT3904; Hfe Min: 100; No. of Transistors: 1; Noise Factor Max: 5; Voltage Vcbo: 60V<!--FANDB--><div class="features-and-benefits-container"><div class="features-and-benefits-description"><span class="features-benefits-value">The MMBT3904 from Fairchild is a surface mount, NPN general purpose amplifier in SOT-23 package. This device is suitable for general purpose amplification and switching applications.</span></div><div class="features-and-benefits-list"><ul class="features-and-benefits-list-list"><li class="features-and-benefits-list-item">Collector to emitter voltage (Vce) of 40V</li><li class="features-and-benefits-list-item">Collector to emitter saturation voltage of 300mV at 50mA collector current</li><li class="features-and-benefits-list-item">Power dissipation of 350mW</li><li class="features-and-benefits-list-item">DC collector current of 200mA</li><li class="features-and-benefits-list-item">DC current gain of 30 at Ic=100mA</li><li class="features-and-benefits-list-item">Operating junction temperature range from -55°C to 150; Supplier 1: Farnell; Manufacturer: ON SEMICONDUCTOR/FAIRCHILD; Manufacturer Part Number: MMBT3904; RoHS: YES; Stock 1: 54090; Pricing 1: 5=0.121, 50=0.043, 250=0.0401, 500=0.0261, 1500=0.0256 (GBP); Transistor Polarity: NPN; DC Current Gain hFE: 300; Transistor Case Style: SOT-23; Operating Temperature Max: 150; Product Range: -; Automotive Qualification Standard: -; MSL: MSL 1 - Unlimited; Collector Emitter Saturation Voltage Vce(on): 200; Continuous Collector Current Ic Max: 200; Current Ic Continuous a Max: 200; Gain Bandwidth ft Min: 300; Gain Bandwidth ft Typ: 300; Operating Temperature Min: -55; Operating Temperature Range: -55°C to +150; Packaging: Cut Tape; Power Dissipation Ptot Max: 350; SMD Marking: 1; ComponentLink1URL: http://www.farnell.com/datasheets/2304127.pdf; ComponentLink1Description: http://www.farnell.com/datasheets/2304127.pdf; ComponentLink2URL: http://www.farnell.com/datasheets/1942444.pdf; ComponentLink2Description: http://www.farnell.com/datasheets/1942444.pdf; Supplier Part Number 1: 9846727
U1 = BQ24296RGET: IC LI+ CHARGER PWR MGMT 24VQFN; Manufacturer: Texas Instruments; Battery Chemistry: Lithium-Ion/Polymer; Number of Cells: 1; Current - Charging: Constant - Programmable; Fault Protection: Over Current, Over Temperature, Over Voltage; Charge Current - Max: 3A; Battery Pack Voltage: 4.2V; Voltage - Supply (Max): 6.2V; Interface: I²C; Manufacturer Part Number: BQ24296RGET; RoHS: RoHS Compliant; Category: Integrated Circuits (ICs); Packaging: Cut Tape (CT); Part Status: Active; Programmable Features: -; Operating Temperature: -40°C ~ 85°C (TA); Package / Case: 24-VFQFN Exposed Pad; Supplier Device Package: 24-VQFN (4x4); ComponentLink1URL: http://www.ti.com/lit/ds/symlink/bq24296.pdf; ComponentLink1Description: http://www.ti.com/lit/ds/symlink/bq24296.pdf; Supplier 1: Farnell; Supplier Part Number 1: 2373541
U2 = TPS630701RNMT: TEXAS INSTRUMENTS - TPS630701RNMT - DC/DC CONV, BUCK-BOOST, 2.4MHZ, VQFN-15; Input Voltage Min: 2; Input Voltage Max: 16; DC / DC Converter IC Case: VQFN; No. of Pins: 15; Output Voltage Nom.: 5; Switching Frequency: 2.4; SVHC: No SVHC (17-Dec-2015; Supplier 1: Farnell; Manufacturer: TEXAS INSTRUMENTS; Manufacturer Part Number: TPS630701RNMT; RoHS: YES; Stock 1: 456; Pricing 1: 1=2.23, 10=1.87, 100=1.7, 250=1.56, 500=1.47, 1000=1.21 (GBP); Topology: Buck-Boost; Output Current: 2; Operating Temperature Max: 125; Packaging: Cut Tape; Product Range: -; Automotive Qualification Standard: -; MSL: MSL 1 - Unlimited; ComponentLink1URL: http://www.ti.com/general/docs/lit/getliterature.tsp?genericPartNumber=TPS63070&fileType=pdf; ComponentLink1Description: http://www.ti.com/general/docs/lit/getliterature.tsp?genericPartNumber=TPS63070&fileType=pdf; Supplier Part Number 1: 2643432
U3 = V_LIN - MCP1810T-30I/J8A: IC REG LINEAR 3V 150MA 8VDFN; Manufacturer: Microchip; Supplier 1: Farnell; Manufacturer Part Number: MCP1810T-30I/J8A; Stock 1: 121; Pricing 1: 1 = 0.41700, 25 = 0.35100, 100 = 0.31200 (EUR); RoHS: No; ComponentLink1URL: http://www.farnell.com/datasheets/2182064.pdf?src-supplier=Farnell; ComponentLink1Description: http://www.farnell.com/datasheets/2182064.pdf?src-supplier=Farnell; ComponentLink2URL: http://www.microchip.com/mymicrochip/filehandler.aspx?ddocname=en587589&src-supplier=Digi-Key; ComponentLink2Description: http://www.microchip.com/mymicrochip/filehandler.aspx?ddocname=en587589&src-supplier=Digi-Key; Supplier Part Number 1: 2678433